# Altium schematic sheet [6]-OPI_POWER.SchDoc
size A4
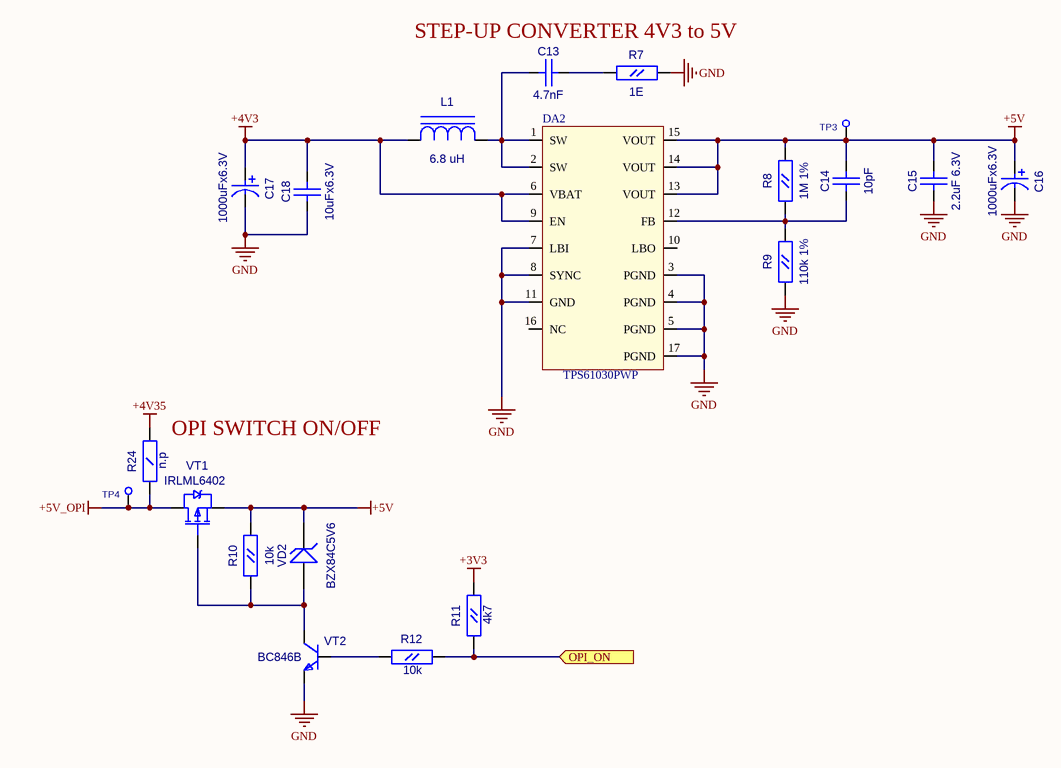
[diagram p0: [6]-OPI_POWER.SchDoc]

## Parts
C13  4.7nF  [CC0603]
C14  10pF  [CC0603]
C15  2.2uF 6.3V  [CC0805]
C16  value 1000uFx6.3V  [CC8X3.5]  (hidden comment: CAP0.35)
C17  value 1000uFx6.3V  [CC8X3.5]  (hidden comment: CAP0.35)
C18  10uFx6.3V  [CC0805]
DA2  TPS61030PWP  [R-PDSO-G16]
L1  6.8 uH  [SDR0805]
R7  1E  [RC0603]
R8  1M 1%  [RC0603]
R9  110k 1%  [RC0603]
R10  10k  [RC0603]
R11  4k7  [RC0603]
R12  10k  [RC0603]
R24  n.p  [RC1206]
TP3  TESTPOINT1  [TESTPOINT1]  (value not drawn)
TP4  TESTPOINT1  [TESTPOINT1]  (value not drawn)
VD2  BZX84C5V6  [SOT-23(123)]
VT1  IRLML6402  [SOT-23(123)]
VT2  BC846B  [SOT-23(123)]

## Ports
OPI_ON (in)

## Nets
+3V3: R11.2(B)
+4V3: C17.1 C18.2(B) DA2.6(VBAT) DA2.9(EN) L1.1(C)
+4V35: R24.2(B)
+5V: C14.2(B) C15.2(B) C16.1 DA2.13(VOUT) DA2.14(VOUT) DA2.15(VOUT) R8.2(B) R10.2(B) TP3.1 VD2.3(K) VT1.2(S)
+5V_OPI: R24.1(A) TP4.1 VT1.3(D)
GND: C15.1(A) C16.2 C17.2 C18.1(A) DA2.3(PGND) DA2.4(PGND) DA2.5(PGND) DA2.7(LBI) DA2.8(SYNC) DA2.11(GND) DA2.17(PGND) R7.2(B) R9.1(A) VT2.2(E)
OPI_ON: R11.1(A) R12.2(B) ; port OPI_ON
NetC13_1: C13.1(A) DA2.1(SW) DA2.2(SW) L1.2(A)
NetC13_2: C13.2(B) R7.1(A)
NetC14_1: C14.1(A) DA2.12(FB) R8.1(A) R9.2(B)
NetR10_1: R10.1(A) VD2.1(A) VT1.1(G) VT2.3(C)
NetR12_1: R12.1(A) VT2.1(B)

Not connected (* = marked no-connect by the designer): DA2 10(LBO) 16(NC)

## Notes on the sheet
- STEP-UP CONVERTER 4V3 to 5V
- (near R24) OPI SWITCH ON/OFF

## Library data of the parts
C13 C14 = CC0603
  C13: Value: 4.7nF
  C14: Value: 10pF
C15 C18 = CC0805
  C15: Value: 2.2uF 6.3V
  C18: Value: 10uFx6.3V
DA2 = TPS61030PWP: Boost converter
L1 = SDR0805: Value: 6.8 uH
R7-R12 = RC0603
  R7: Value: 1E
  R8: Value: 1M 1%
  R9: Value: 110k 1%
  R10 R12: Value: 10k
  R11: Value: 4k7
R24 = RC1206: Value: n.p
VD2 = BZX84: Zener Voltage Regulator Diode; Value: BZX84C5V6
VT1 = IRLML6402: HEXFET Power MOSFET; OriginalName: IRLML5103; ComponentField7: Published 8-Jun-2000; Value: IRLML6402
VT2 = BC846BLT1: ComponentField7: Published 29-Sep-2000; OriginalName: BC846BLT1; Value: BC846B
TP3 TP4 = TESTPOINT1: Value: *